# EAGLE design power (EAGLE 7.2.0)
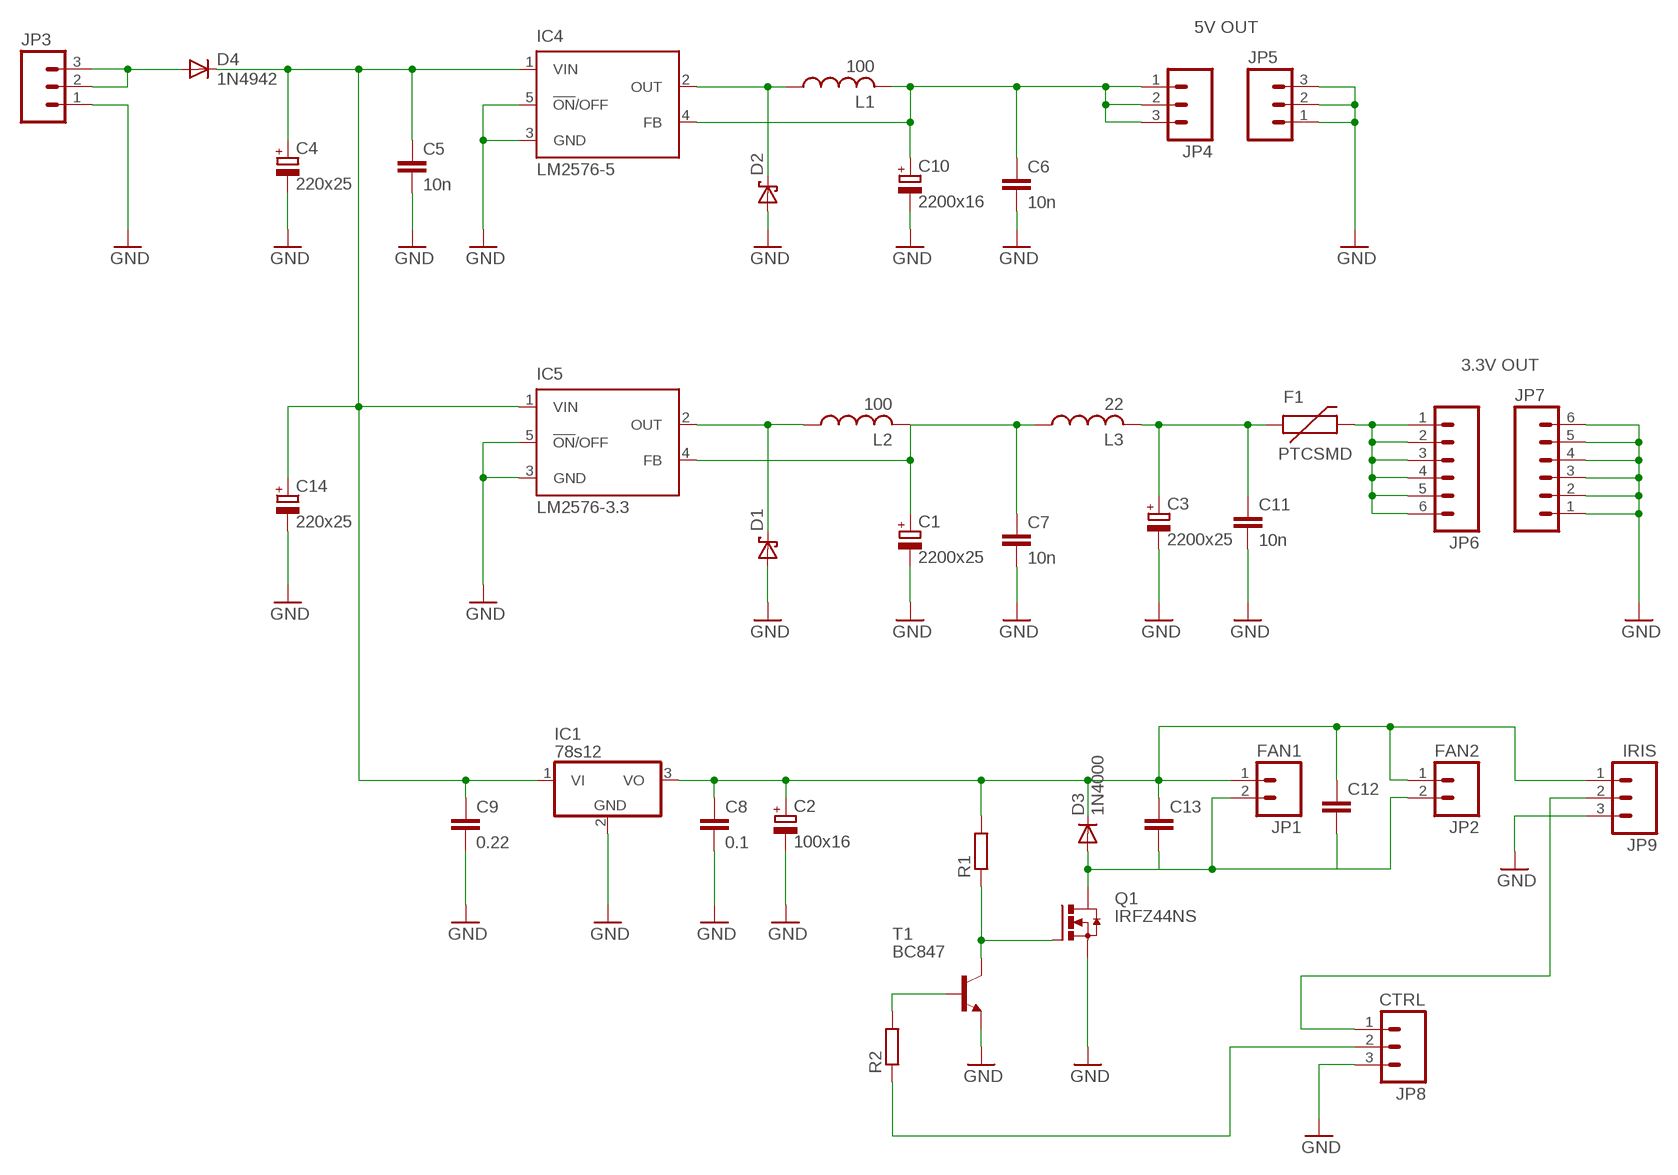
[diagram p0: schematic, sheet 1]

## Parts
C1  2200x25  CPOL-EUE3.5-10  [E3,5-10]
C2  100x16  CPOL-EUE2.5-7  [E2,5-7]
C3  2200x25  CPOL-EUE3.5-10  [E3,5-10]
C4  220x25  CPOL-EUE3.5-10  [E3,5-10]
C5  10n  CAP0805  [0805]
C6  10n  CAP0805  [0805]
C7  10n  CAP0805  [0805]
C8  0.1  CAP0805  [0805]
C9  0.22  CAP0805  [0805]
C10  2200x16  CPOL-EUE3.5-10  [E3,5-10]
C11  10n  CAP0805  [0805]
C12  C-EUC0805K  [C0805K]
C13  C-EUC0805K  [C0805K]
C14  220x25  CPOL-EUE3.5-10  [E3,5-10]
D1  DS_E2L  [E2LINE]
D2  DS_E2L  [E2LINE]
D3  1N4000  1N4004  [DO41-10]
D4  1N4942  [DO41-10]
F1  PTCSMD  [PTC-1206]
IC1  78s12  7806T  [TO220H]
IC4  LM2576-5  LM2596S  [TO263-5]
IC5  LM2576-3.3  LM2596S  [TO263-5]
JP1  FAN1  M02JST-PTH-VERT  [JST-2-PTH-VERT]
JP2  FAN2  M02JST-PTH-VERT  [JST-2-PTH-VERT]
JP3  M03JST-PTH-VERT  [JST-3-PTH-VERT]
JP4  M03LOCK  [1X03_LOCK]
JP5  M03LOCK  [1X03_LOCK]
JP6  M06LOCK  [1X06_LOCK]
JP7  M06LOCK  [1X06_LOCK]
JP8  CTRL  M03PTH  [1X03]
JP9  IRIS  M03PTH  [1X03]
L1  100  L-USL8530M  [L8530M]
L2  100  L-USL8530M  [L8530M]
L3  22  L-USL8530M  [L8530M]
Q1  IRFZ44NS  IRF3704S  [D2PACK]
R1  R-EU_R0805  [R0805]
R2  R-EU_R0805  [R0805]
T1  BC847  [SOT23]

## Nets
GND: C1.- C2.- C3.- C4.- C5.2 C6.2 C7.2 C8.2 C9.2 C10.- C11.2 C14.- D1.2(A) D2.2(A) IC1.2(GND) IC4.3(GND) IC4.5(!ON!/OFF) IC5.3(GND) IC5.5(!ON!/OFF) JP3.1 JP5.1 JP5.2 JP5.3 JP7.1 JP7.2 JP7.3 JP7.4 JP7.5 JP7.6 JP8.3 JP9.3 Q1.3(S) T1.2(E)
N$1: C12.2 C13.2 D3.A JP1.2 JP2.2 Q1.2(D)
N$2: C4.+ C5.1 C9.1 C14.+ D4.C IC1.1(VI) IC4.1(VIN) IC5.1(VIN)
N$3: D2.1(K) IC4.2(OUT) L1.1
N$4: JP8.2 R2.1
N$5: C6.1 C10.+ IC4.4(FB) JP4.1 JP4.2 JP4.3 L1.2
N$6: Q1.1(G) R1.1 T1.3(C)
N$7: R2.2 T1.1(B)
N$8: D1.1(K) IC5.2(OUT) L2.1
N$9: C2.+ C8.1 C12.1 C13.1 D3.C IC1.3(VO) JP1.1 JP2.1 JP9.1 R1.2
N$10: D4.A JP3.2 JP3.3
N$11: JP8.1 JP9.2
N$12: C1.+ C7.1 IC5.4(FB) L2.2 L3.1
N$13: F1.2 JP6.1 JP6.2 JP6.3 JP6.4 JP6.5 JP6.6
N$14: C3.+ C11.1 F1.1 L3.2

## Notes on the sheet
- 5V OUT
- 3.3V OUT

## Library data of the parts
C1-C4 C10 C14 = rcl:CPOL-EU: POLARIZED CAPACITOR, European symbol
C5-C9 C11 = SparkFun-Capacitors:CAP: Capacitor Standard 0603 ceramic capacitor, and 0.1" leaded capacitor.
C12 C13 = rcl:C-EU: CAPACITOR, European symbol
D1 D2 = zetex:DS_E2L: SHOTTKY DIODE; OC_FARNELL: unknown; OC_NEWARK: unknown
D3 = diode:1N4004: DIODE general purpose rectifier, 1 A
D4 = diode:1N4942: DIODE 1.0 A, 200 V, 150 ns
F1 = SparkFun-PowerIC:PTC: Resettable Fuse PTC Resettable Fuse. Spark Fun Electronics SKU : COM-08357; PROD_ID: RES-11150
IC1 = linear:78*: Positive VOLTAGE REGULATOR Source: http://cache.national.com/ds/LM/LM78L05.pdf http://www.fairchildsemi.com/ds/LM/LM7805.pdf
IC4 IC5 = national-semiconductor:LM2596: SIMPLE SWITCHER® Power Converter 150 kHz 3A Step-Down Voltage Regulator Source: http://www.national.com/ds/LM/LM2596.pdf; MF: NATIONAL SEMICONDUCTOR; MPN: LM2596S-ADJ/NOPB; OC_FARNELL: 9494367; OC_NEWARK: 41K3842
JP1 JP2 = SparkFun-Connectors:M02: Standard 2-pin 0.1" header. Use with - straight break away headers ( PRT-00116) - right angle break away headers (PRT-00553) - swiss pins (PRT-00743) - machine pins (PRT-00117) - female headers (PRT-00115) Molex polarized connector foot print use with: PRT-08233 with associated crimp pins and housings. 2.54_SCREWTERM for use with PRT-10571. 3.5mm Screw Terminal footprints for PRT-08084 5mm Screw Terminal footprints for use with PRT-08433
JP3-JP5 JP8 JP9 = SparkFun-Connectors:M03: Header 3 Standard 3-pin 0.1" header. Use with straight break away headers (SKU : PRT-00116), right angle break away headers (PRT-00553), swiss pins (PRT-00743), machine pins (PRT-00117), and female headers (PRT-00115). Molex polarized connector foot print use with SKU : PRT-08232 with associated crimp pins and housings.
JP6 JP7 = SparkFun-Connectors:M06: Header 6 Standard 6-pin 0.1" header. Use with straight break away headers (SKU : PRT-00116), right angle break away headers (PRT-00553), swiss pins (PRT-00743), machine pins (PRT-00117), and female headers (PRT-00115). Molex polarized connector foot print use with SKU : PRT-08094 with associated crimp pins and housings. NOTES ON THE VARIANTS LOCK and LOCK_LONGPADS... This footprint was designed to help hold the alignment of a through-hole component (i.e. 6-pin header) while soldering it into place. You may notice that each hole has been shifted either up or down by 0.005 of an inch from it's more standard position (which is a perfectly straight line). This slight alteration caused the pins (the squares in the middle) to touch the edges of the holes. Because they are alternating, it causes a "brace" to hold the component in place. 0.005 has proven to be the perfect amount of "off-center" position when using our standard breakaway headers. Although looks a little odd when you look at the bare footprint, once you have a header in there, the alteration is very hard to notice. Also,if you push a header all the way into place, it is covered up entirely on the bottom side. This idea of altering the position of holes to aid alignment will be further integrated into the Sparkfun Library for other footprints. It can help hold any component with 3 or more connection pins.
L1-L3 = rcl:L-US: INDUCTOR, American symbol
Q1 = transistor-power:IRF3704: SMPS MOSFET HEXFET® Power MOSFET Source: http://www.irf.com/product-info/datasheets/data/irf3704.pdf
R1 R2 = rcl:R-EU_: RESISTOR, European symbol
T1 = transistor:BC847: NPN TRANSISTOR

## Board
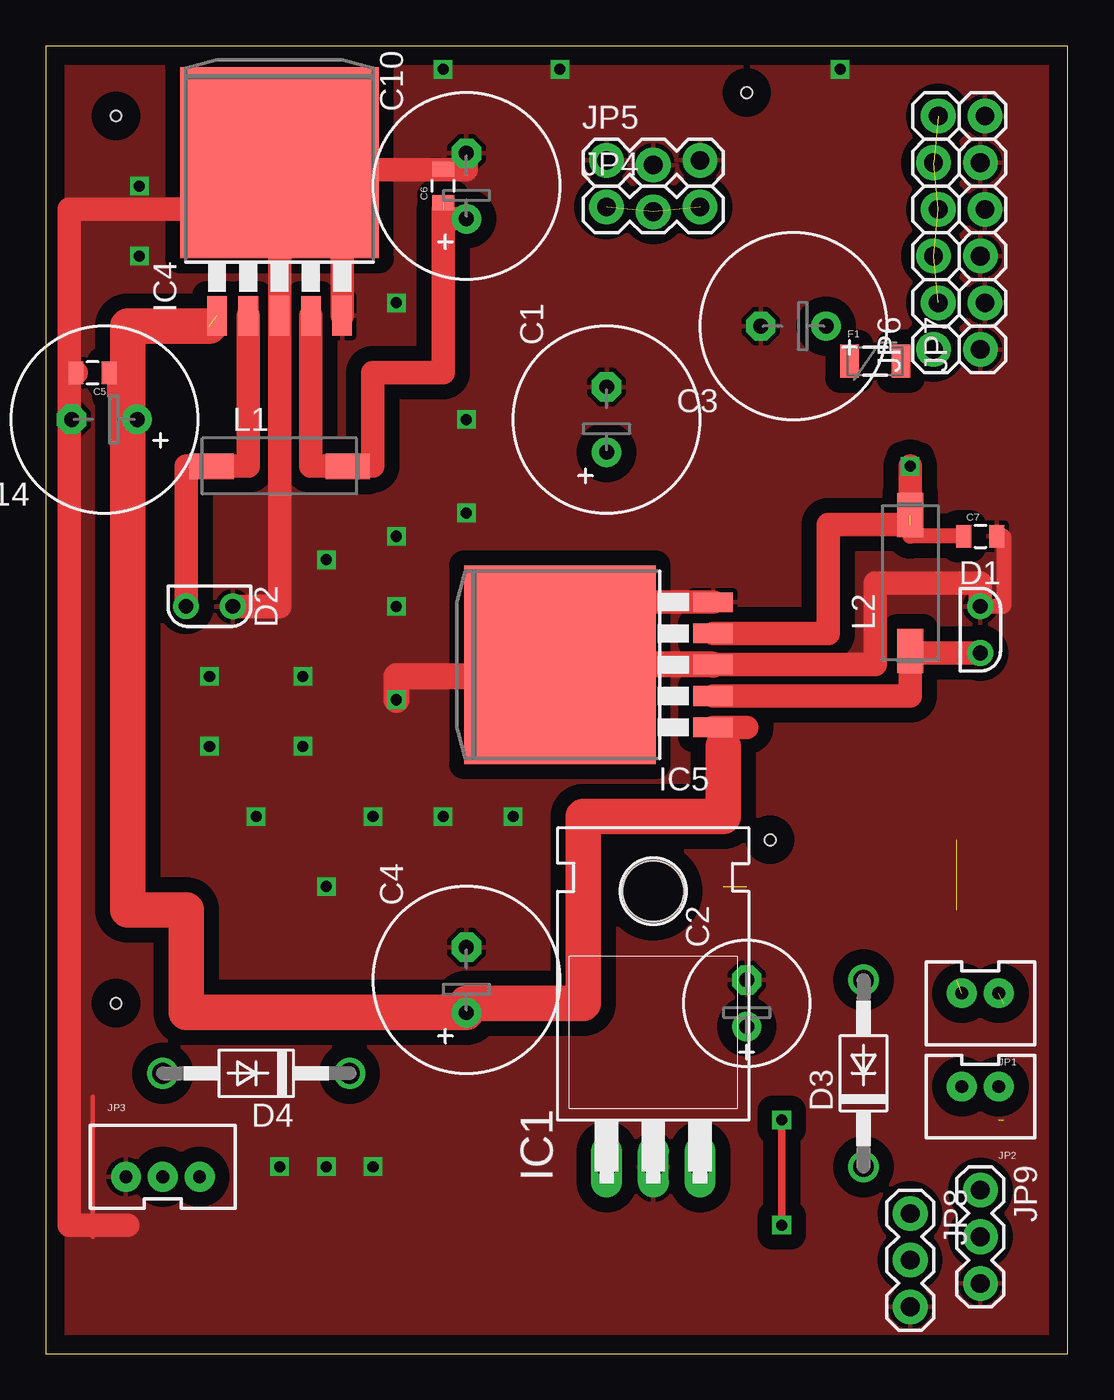
[diagram p1: board, top side]
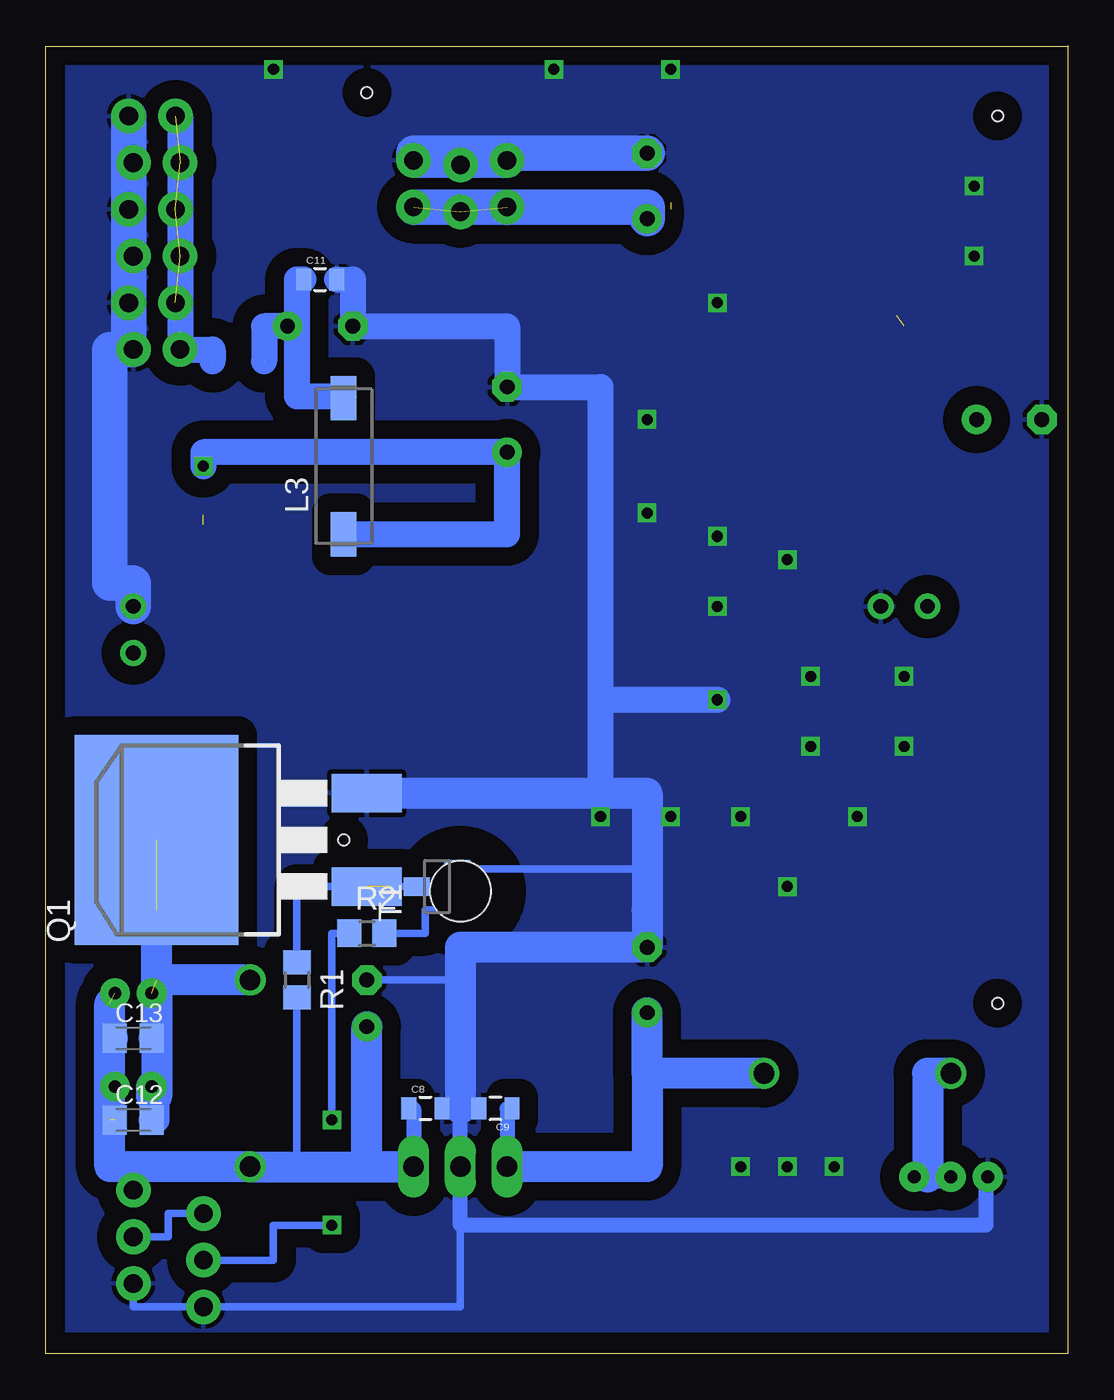
[diagram p2: board, bottom side, seen from below]

Size 55.55 x 71.12 mm. Coordinates in mm from the lower left corner, seen from the top.
Outline: 0,71.11 55.55,71.11 55.55,0 0,0 0,71.11
Outline: 0,71.12 0,71.11
Copper layers (1*16): Top 0.035mm / dielectric 1.5mm / Bottom 0.035mm
Design rules "default": minimum track width 10mil, minimum drill 24mil, track to track 6mil, track to pad 8mil, pad to pad 8mil, via to via 6mil, smd to smd 8mil, copper to edge 40mil, drill to drill 8mil, minimum pad ring 10mil, minimum via ring 8mil, stop-mask expansion 4mil, vias tented up to drill 0mil, thermal gap 10mil
Holes 0.6 mm at 3.81,67.31 38.1,68.58 3.81,19.05 39.37,27.94

### Footprints (pad centres in the part's own frame; a part is rotated, then mirrored left to right if it is on the bottom)
E3,5-10 = drill 0.813 pad 1.6: + -1.778,0 | drill 0.813 pad 1.6 octagon: - 1.778,0
E2,5-7 = drill 0.813 pad 1.6: + -1.27,0 | drill 0.813 pad 1.6 octagon: - 1.27,0
0805 = smd 0.8 x 1.2: 1 -0.9,0; 2 0.9,0
C0805K = smd 1.3 x 1.6: 1 -1,0; 2 1,0
E2LINE = drill 0.8 pad 1.397: 1 0,-1.27; 2 0,1.27
DO41-10 = drill 1.118: A 5.08,0; C -5.08,0
PTC-1206 = smd 1 x 1.8: 1 -1.4,0; 2 1.4,0
TO220H = drill 1.118 long: 1 -2.54,-10.16; 2 0,-10.16; 3 2.54,-10.16 | hole 3.302: 0,4.826
TO263-5 = smd 1.067 x 2.159: 1 -3.404,-5.791; 2 -1.702,-5.791; 3 0,-5.791; 4 1.702,-5.791; 5 3.404,-5.791 | smd 10.8 x 10.41: 6 0,2.54
JST-2-PTH-VERT = drill 0.7 pad 1.626: 1 -1,-0.55; 2 1,-0.55
JST-3-PTH-VERT = drill 0.7 pad 1.626: 1 -2,-0.55; 2 0,-0.55; 3 2,-0.55
1X03_LOCK = drill 1.016 pad 1.88: 1 0,0.127; 2 2.54,-0.127; 3 5.08,0.127
1X06_LOCK = drill 1.016 pad 1.88: 1 0,0; 2 2.54,-0.254; 3 5.08,0; 4 7.62,-0.254; 5 10.16,0; 6 12.7,-0.254
1X03 = drill 1.016 pad 1.88: 1 0,0; 2 2.54,0; 3 5.08,0
L8530M = smd 2.4 x 1.4: 1 -3.7,0; 2 3.7,0
D2PACK = smd 2.083 x 3.81: 1 -2.54,-8.89; 3 2.54,-8.89 | smd 11.43 x 8.89: 2 0,2.54
R0805 = smd 1.3 x 1.5: 1 -0.95,0; 2 0.95,0
SOT23 = smd 1 x 1.4: 1 -0.95,-1.1; 2 0.95,-1.1; 3 0,1.1

### Placement (x,y rotation side)
C1  30.48,50.8 90 top
C2  38.1,19.05 90 top
C3  40.64,55.88 180 top
C4  22.86,20.32 90 top
C5  2.54,53.34 180 top
C6  21.59,63.5 90 top
C7  50.8,44.45 0 top
C8  34.92,13.33 0 bottom
C9  31.11,13.33 180 bottom
C10  22.86,63.5 90 top
C11  40.64,58.42 0 bottom
C12  50.8,12.7 0 bottom
C13  50.8,17.14 0 bottom
C14  3.18,50.8 180 top
D1  50.8,39.37 0 top
D2  8.89,40.64 270 top
D3  44.45,15.24 90 top
D4  11.43,15.24 180 top
F1  45.08,53.98 0 top
IC1  33.02,20.32 0 top
IC4  12.7,62.23 0 top
IC5  30.48,37.47 90 top
JP1  50.8,19.05 180 top
JP2  50.8,13.97 180 top
JP3  6.35,10.16 0 top
JP4  30.48,62.23 0 top
JP5  30.48,64.77 0 top
JP6  48.26,54.61 90 top
JP7  50.8,54.61 90 top
JP8  46.99,7.62 270 top
JP9  50.8,8.89 270 top
L1  12.7,48.26 0 top
L2  46.99,41.91 90 top
L3  39.37,48.26 90 bottom
Q1  46.99,27.94 90 bottom
R1  41.91,20.32 270 bottom
R2  38.1,22.86 0 bottom
T1  34.29,25.4 90 bottom

### Tracks (layer width: path | path; a pad name or v marks a point on that pad's centre or on a via)
GND  (via drill 0.6)
  Top 0.254: C14.- 1.27,50.8 1.27,52.07 1.27,55.88 | 4.45,6.98 2.54,6.98 | 2.54,6.98 2.54,6.35 | 2.54,6.98 2.54,13.97
  Top 0.813: C7.2 52.07,44.45 52.07,40.64 D1.2
  Top 1.27: 12.7,62.23 IC4.3 12.7,40.64 D2.2 | 12.7,62.23 16.1,62.23 IC4.5 | IC5.5 30.48,40.87 30.48,37.47 IC5.3 45.08,37.47 45.08,41.91 50.8,41.91 D1.2 | 4.45,6.98 1.27,6.98 1.27,52.07 1.27,53.34 | 1.27,53.34 1.27,55.88 1.27,62.23 12.7,62.23 | C5.2 1.27,53.34 | C10.- 22.86,64.4 C6.2 12.7,64.4 12.7,62.23
  Top 1.422: IC5.3 31.75,37.47 31.75,36.83 19.05,36.83 v19.05,35.56
  Bottom 0.406: T1.2 22.86,26.35 22.86,24.13 | C2.- 33.02,20.32 | JP9.3 50.8,2.54 33.02,2.54 33.02,6.98
  Bottom 0.813: C9.2 33.02,13.33 | 33.02,13.33 C8.2 | 33.02,13.33 IC1.2 33.02,6.98 4.45,6.98 4.45,9.61 JP3.1
  Bottom 1.422: 25.4,35.56 25.4,52.58 C1.- 30.48,55.88 C3.- 38.86,58.42 C11.2 | 25.4,35.56 25.4,30.48 | v19.05,35.56 25.4,35.56
  Bottom 1.676: 33.02,13.33 33.02,20.32 33.02,22.1 C4.- 22.86,24.13 22.86,30.48 25.4,30.48 Q1.3
  Bottom 1.93: JP5.1 JP5.3 35.56,65.28 C10.- | JP7.6 51.05,54.61 JP7.1 52.07,54.61 52.07,41.91 50.8,41.91 D1.2
  other vias: 27.94,69.85 43.18,69.85 21.59,69.85 5.08,59.69 19.05,57.15 22.86,50.8 22.86,45.72 19.05,40.64 8.89,33.02 13.97,33.02 11.43,29.21 17.78,29.21 15.24,25.4 5.08,63.5 12.7,10.16 15.24,10.16 17.78,10.16 25.4,29.21 21.59,29.21 13.97,36.83 8.89,36.83 19.05,44.45 15.24,43.18
  pour Bottom (isolate 1.016): 0,71.12 54.61,71.12 54.61,1.27 0,1.27 0,69.85
  pour Top (isolate 0.813): 0,71.12 54.61,71.12 54.61,0 0,0
N$1  (2 unrouted)
  Bottom 1.422: C12.2 49.53,12.7 49.53,13.97 | C13.2 49.53,17.14 49.53,17.78
  Bottom 1.676: D3.A 49.53,20.32 | 49.53,20.32 49.53,17.78 49.53,13.97 49.8,13.97 JP2.2 | 49.53,20.32 49.53,24.13
N$2  (1 unrouted)
  Top 0.254: C14.+ 4.45,50.8 4.45,52.07 3.44,52.07 C5.1
  Top 0.813: IC5.1 36.83,34.06 36.83,33.02
  Top 1.27: IC5.1 38.1,34.06
  Top 1.93: 8.89,55.88 4.45,55.88 4.45,52.07 4.45,24.13 7.62,24.13 7.62,18.54 C4.+ 22.86,19.05 29.21,19.05 29.21,29.21 36.83,29.21 36.83,33.02
  Bottom 0.813: C9.1 30.48,13.33 IC1.1
  Bottom 1.676: D4.C 22.86,15.24 | 22.86,15.24 C4.+ | 22.86,15.24 22.86,10.16 IC1.1
N$3
  Top 1.27: IC4.2 11,48.26 L1.1 7.62,48.26 D2.1
N$4  (via drill 0.6)
  Top 0.406: v40,12.7 v40,6.98
  Bottom 0.406: R2.1 40,22.86 v40,12.7 | v40,6.98 43.18,6.98 43.18,5.08 JP8.2
N$5  (3 unrouted)
  Top 1.27: IC4.4 14.4,48.26 L1.2 17.78,48.26 17.78,53.34 21.59,53.34 21.59,61.72 | C10.+ 21.59,61.72 | 21.59,61.72 21.59,62.23
  Bottom 1.93: JP4.3 22.86,62.36 C10.+
N$6  (1 unrouted)
  Bottom 0.406: T1.3 36.83,25.4 | R1.1 41.91,25.4 Q1.1
N$7
  Bottom 0.406: T1.1 33.02,24.45 33.02,24.13 34.92,24.13 34.92,22.86 R2.2
N$8
  Top 1.27: IC5.2 46.99,35.76 L2.1 46.99,38.1 D1.1
N$9  (2 unrouted)
  Bottom 0.406: R1.2 41.91,10.16 | JP9.1 50.8,10.16
  Bottom 0.813: C8.1 35.56,13.33 IC1.3
  Bottom 1.422: JP2.1 52.07,14.52 52.07,12.7 | C13.1 52.07,17.14 52.07,17.78
  Bottom 1.676: C2.+ 38.1,10.16 IC1.3 41.91,10.16 D3.C 50.8,10.16 52.07,10.16 52.07,12.7 52.07,17.78 52.07,19.05
N$10
  Bottom 1.27: JP3.2 7.62,9.61 JP3.3
  Bottom 1.676: D4.A 7.62,15.24 7.62,9.61
N$11
  Bottom 0.406: JP8.1 48.89,7.62 48.89,6.35 JP9.2
N$12  (via drill 0.6)  (1 unrouted)
  Top 0.813: C7.1 46.99,44.45 46.99,45.09
  Top 1.27: IC5.4 42.54,39.17 42.54,45.09 46.99,45.09 | v46.99,48.26 L2.2
  Bottom 1.422: v46.99,48.26 46.99,49.02 C1.+ 30.48,44.56 L3.1
N$13  (5 unrouted)
  Bottom 1.422: JP6.6 48.26,67.31 JP6.1 46.48,54.61 F1.2
N$14  (1 unrouted)
  Bottom 1.422: F1.1 43.68,55.88 C3.+ 41.91,55.88 | 41.91,55.88 41.91,52.07 39.37,52.07 L3.2 | C11.1 41.91,58.42 41.91,55.88